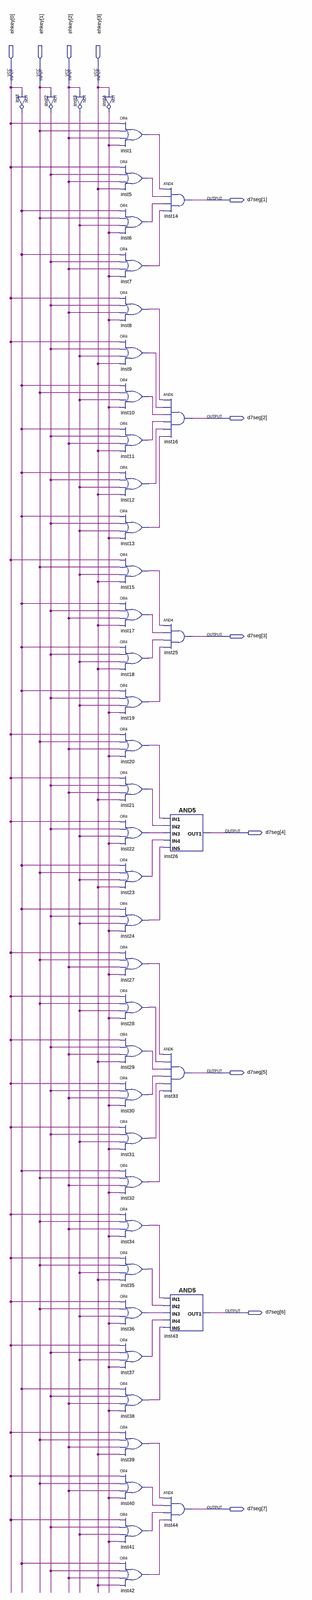
[diagram p0: schematic sheet, whole]
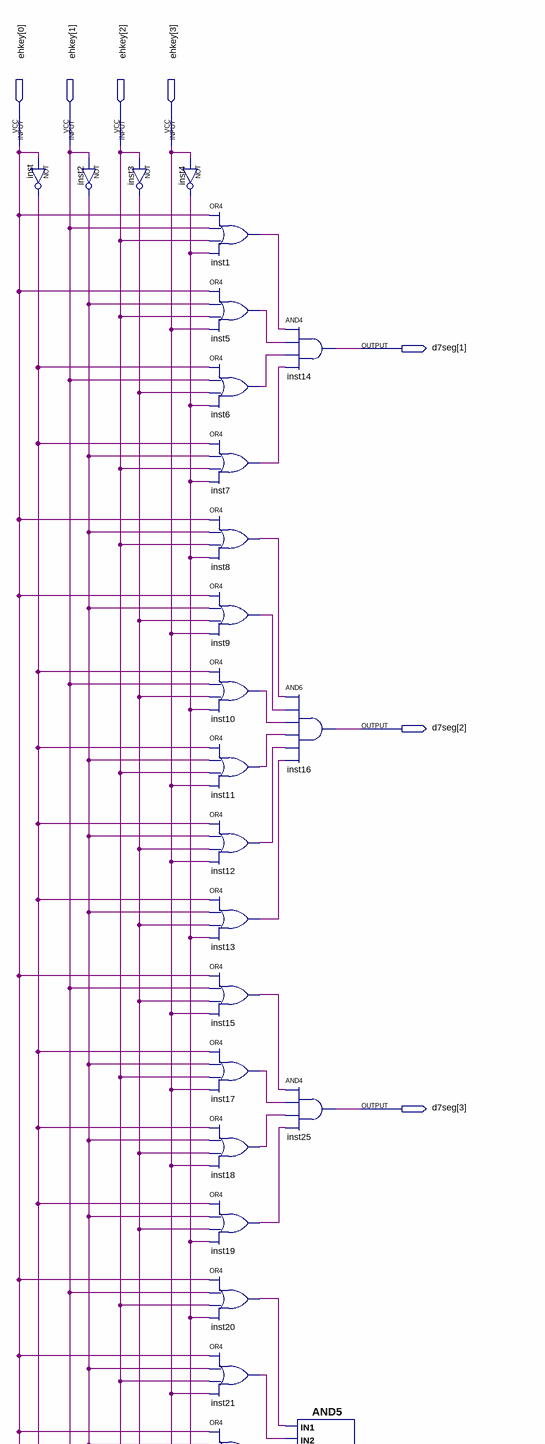
[diagram p1: schematic sheet, upper part]
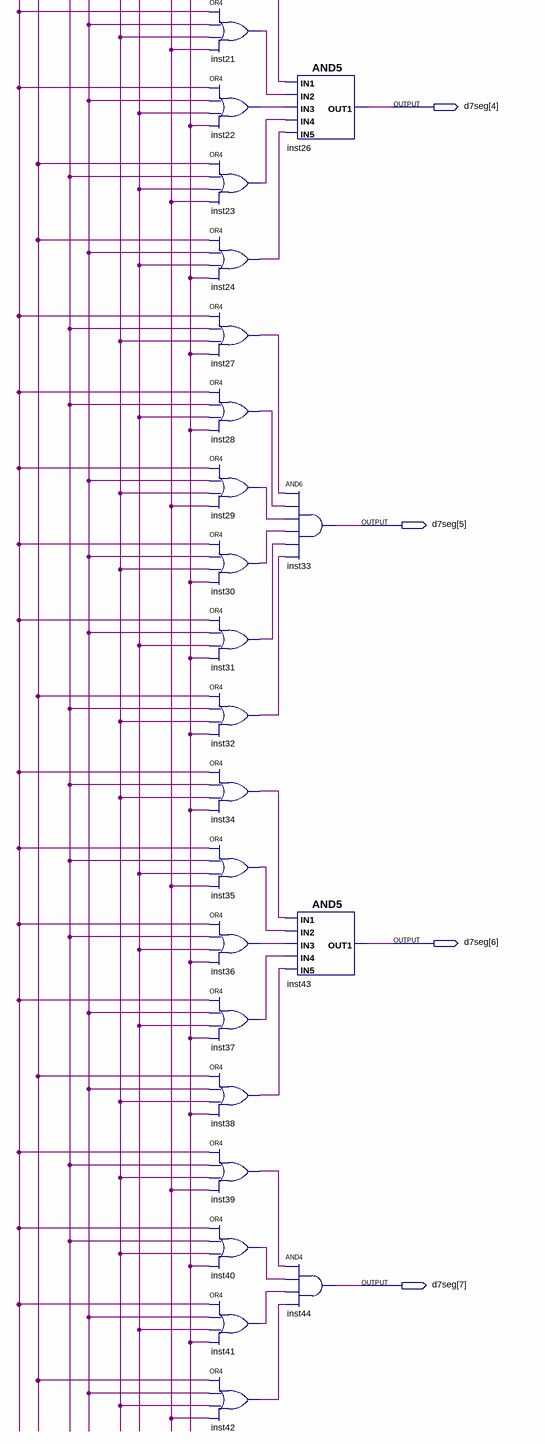
[diagram p2: schematic sheet, lower part]
// Quartus schematic d7seghexadecimal.bdf as structural Verilog: 45 symbols, 11 pins
module d7seghexadecimal (
  input  [3:0] ehkey,
  output [7:1] d7seg
);

  wire inst1_out, inst2_out, inst3_out, inst4_out, inst5_out, inst6_out, inst7_out, inst8_out, inst9_out,
       inst10_out, inst11_out, inst12_out, inst13_out, inst15_out, inst17_out, inst18_out, inst19_out,
       inst20_out, inst21_out, inst22_out, inst23_out, inst24_out, inst27_out, inst28_out, inst29_out,
       inst30_out, inst31_out, inst32_out, inst34_out, inst35_out, inst36_out, inst37_out, inst38_out,
       inst39_out, inst40_out, inst41_out, inst42_out, inst_out;

  not inst (inst_out, ehkey[0]);
  not inst2 (inst2_out, ehkey[1]);
  not inst3 (inst3_out, ehkey[2]);
  not inst4 (inst4_out, ehkey[3]);
  or inst1 (inst1_out, ehkey[0], ehkey[1], ehkey[2], inst4_out);
  or inst5 (inst5_out, ehkey[0], inst2_out, ehkey[2], ehkey[3]);
  or inst6 (inst6_out, inst_out, ehkey[1], inst3_out, inst4_out);
  or inst7 (inst7_out, inst_out, inst2_out, ehkey[2], inst4_out);
  or inst8 (inst8_out, ehkey[0], inst2_out, ehkey[2], inst4_out);
  or inst9 (inst9_out, ehkey[0], inst2_out, inst3_out, ehkey[3]);
  or inst10 (inst10_out, inst_out, ehkey[1], inst3_out, inst4_out);
  or inst11 (inst11_out, inst_out, inst2_out, ehkey[2], ehkey[3]);
  or inst12 (inst12_out, inst_out, inst2_out, inst3_out, ehkey[3]);
  or inst13 (inst13_out, inst_out, inst2_out, inst3_out, inst4_out);
  or inst15 (inst15_out, ehkey[0], ehkey[1], inst3_out, ehkey[3]);
  or inst17 (inst17_out, inst_out, inst2_out, ehkey[2], ehkey[3]);
  or inst18 (inst18_out, inst_out, inst2_out, inst3_out, ehkey[3]);
  or inst19 (inst19_out, inst_out, inst2_out, inst3_out, inst4_out);
  or inst20 (inst20_out, ehkey[0], ehkey[1], ehkey[2], inst4_out);
  or inst21 (inst21_out, ehkey[0], inst2_out, ehkey[2], ehkey[3]);
  or inst22 (inst22_out, ehkey[0], inst2_out, inst3_out, inst4_out);
  or inst23 (inst23_out, inst_out, ehkey[1], inst3_out, ehkey[3]);
  or inst24 (inst24_out, inst_out, inst2_out, inst3_out, inst4_out);
  or inst27 (inst27_out, ehkey[0], ehkey[1], ehkey[2], inst4_out);
  or inst28 (inst28_out, ehkey[0], ehkey[1], inst3_out, inst4_out);
  or inst29 (inst29_out, ehkey[0], inst2_out, ehkey[2], ehkey[3]);
  or inst30 (inst30_out, ehkey[0], inst2_out, ehkey[2], inst4_out);
  or inst31 (inst31_out, ehkey[0], inst2_out, inst3_out, inst4_out);
  or inst32 (inst32_out, inst_out, ehkey[1], ehkey[2], inst4_out);
  or inst34 (inst34_out, ehkey[0], ehkey[1], ehkey[2], inst4_out);
  or inst35 (inst35_out, ehkey[0], ehkey[1], inst3_out, ehkey[3]);
  or inst36 (inst36_out, ehkey[0], ehkey[1], inst3_out, inst4_out);
  or inst37 (inst37_out, ehkey[0], inst2_out, inst3_out, inst4_out);
  or inst38 (inst38_out, inst_out, inst2_out, ehkey[2], inst4_out);
  or inst39 (inst39_out, ehkey[0], ehkey[1], ehkey[2], ehkey[3]);
  or inst40 (inst40_out, ehkey[0], ehkey[1], ehkey[2], inst4_out);
  or inst41 (inst41_out, ehkey[0], inst2_out, inst3_out, inst4_out);
  or inst42 (inst42_out, inst_out, inst2_out, ehkey[2], ehkey[3]);
  and inst14 (d7seg[1], inst1_out, inst5_out, inst6_out, inst7_out);
  and inst16 (d7seg[2], inst8_out, inst9_out, inst10_out, inst11_out, inst12_out, inst13_out);
  and inst25 (d7seg[3], inst15_out, inst17_out, inst18_out, inst19_out);
  AND5 inst26 (
    .IN3(inst22_out), .IN2(inst21_out), .IN1(inst20_out), .IN5(inst24_out), .IN4(inst23_out), .OUT1(d7seg[4]));
  and inst33 (d7seg[5], inst27_out, inst28_out, inst29_out, inst30_out, inst31_out, inst32_out);
  AND5 inst43 (
    .IN3(inst36_out), .IN2(inst35_out), .IN1(inst34_out), .IN5(inst38_out), .IN4(inst37_out), .OUT1(d7seg[6]));
  and inst44 (d7seg[7], inst39_out, inst40_out, inst41_out, inst42_out);
endmodule
